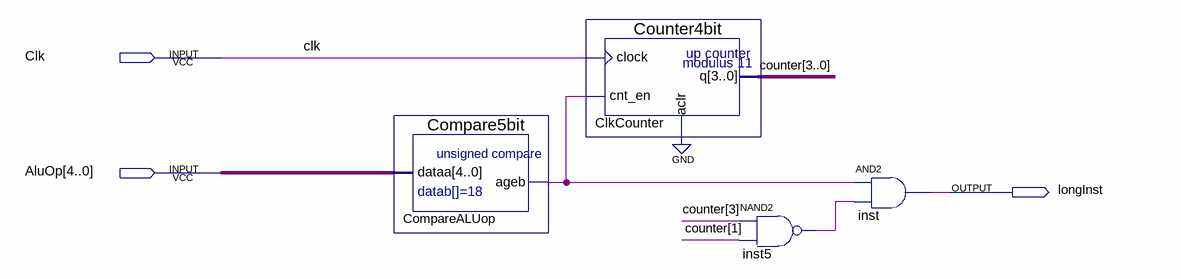
[diagram p0: schematic sheet]
// Quartus schematic LongInstruction.bdf as structural Verilog: 4 symbols, 3 pins
module LongInstruction (
  input  Clk,
  input  [4:0] AluOp,
  output longInst
);

  wire CompareALUop_ageb, inst5_out;
  wire [3:0] counter;

  Compare5bit CompareALUop (.dataa(AluOp), .ageb(CompareALUop_ageb));
  Counter4bit ClkCounter (.clock(Clk), .cnt_en(CompareALUop_ageb), .aclr(1'b0), .q(counter));
  nand inst5 (inst5_out, counter[3], counter[1]);
  and inst (longInst, CompareALUop_ageb, inst5_out);
endmodule
